# Altium schematic sheet [7]-POWER_DCDC_3V3.SchDoc
size A3; SheetNumber: 8; SheetTotal: 8
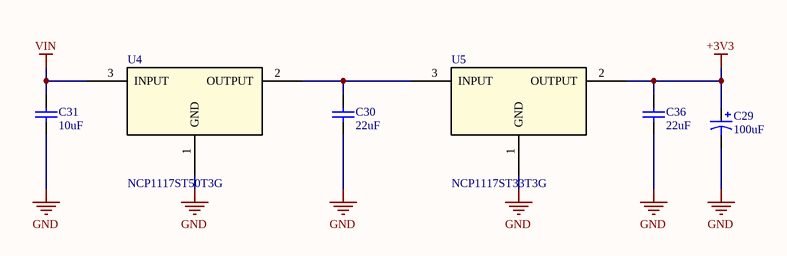
[diagram p0: [7]-POWER_DCDC_3V3.SchDoc]

## Parts
C29  100uF  [CAPAE6553X55M]
C30  22uF  [CAPC2012N]
C31  10uF  [CAPC2012N]
C36  22uF  [CAPC2012N]
U4  NCP1117ST50T3G  [SOT230P700X180-4N]
U5  NCP1117ST33T3G  [SOT230P700X180-4N]

## Nets
+3V3: C29.1 C36.2 U5.2(OUTPUT)
GND: C29.2 C30.1 C31.1 C36.1 U4.1(GND) U5.1(GND)
VIN: C31.2 U4.3(INPUT)
NetC30_2: C30.2 U4.2(OUTPUT) U5.3(INPUT)

## Library data of the parts
C29 = EEE-1AA101WR: CAP ALUM 100UF 20% 10V SMD; Manufacturer 1: Panasonic ECG; Description 1: Cap Aluminum Lytic 100uF 10V 20% (5 X 5.4mm) SMD 50mA 1000h 85C Automotive T/R; Ripple Current: 50mA; Life (Hours): 1000Hour; Supplier 1: Digi-Key; Manufacturer Part Number 1: EEE-1AA101WR; Stock 1: 122621; Pricing 1: 1=0.31, 10=0.212, 100=0.1272, 500=0.0954 (USD); Mount: Surface Mount,PCB; Case/Package: Radial; Contact Plating: Tin; Min Operating Temperature: -40°C; Max Operating Temperature: 85°C; Capacitance: 100uF; Tolerance: 20%; Voltage Rating: 10V; Packaging: Tape and Reel; Package Quantity: 1; Voltage Rating (DC): 10V; Termination: SMD/SMT; Ripple Current (AC): 50mA; Diameter: 5mm; Length: 5.5mm; Height: 5.4mm; Height - Seated (Max): 0.213inch; Radiation Hardening: No; Lead Free: Lead Free; REACH SVHC: Unknown; ComponentLink1URL: https://datasheet.ciiva.com/26945/getdatasheetpartid-169213-26945071.pdf; ComponentLink1Description: https://datasheet.ciiva.com/26945/getdatasheetpartid-169213-26945071.pdf; ComponentLink2URL: https://datasheet.ciiva.com/2983/aba0000ce2-2983906.pdf; ComponentLink2Description: https://datasheet.ciiva.com/2983/aba0000ce2-2983906.pdf; ComponentLink3URL: https://datasheet.ciiva.com/24027/aba0000ce2-40801-24027541.pdf; ComponentLink3Description: https://datasheet.ciiva.com/24027/aba0000ce2-40801-24027541.pdf; ComponentLink4URL: https://datasheet.ciiva.com/30075/11aba0000ce2-30075303.pdf; ComponentLink4Description: https://datasheet.ciiva.com/30075/11aba0000ce2-30075303.pdf; ComponentLink5URL: https://datasheet.ciiva.com/16427/aba0000ce2-16427544.pdf; ComponentLink5Description: https://datasheet.ciiva.com/16427/aba0000ce2-16427544.pdf; ComponentLink6URL: https://datasheet.ciiva.com/14598/70255710-14598233.pdf; ComponentLink6Description: https://datasheet.ciiva.com/14598/70255710-14598233.pdf; ComponentLink7URL: https://datasheet.ciiva.com/14605/70255710-14605689.pdf; ComponentLink7Description: https://datasheet.ciiva.com/14605/70255710-14605689.pdf; ComponentLink8URL: https://datasheet.ciiva.com/11673/aba0000ce2-11673882.pdf; ComponentLink8Description: https://datasheet.ciiva.com/11673/aba0000ce2-11673882.pdf; Supplier Part Number 1: PCE3867CT-ND
C30 C36 = JMK212BJ226MG-T: CAP CER 22UF 6.3V X5R 0805; Manufacturer 1: Taiyo Yuden; PCN Part Number: X5R, X7R Dielectrics 23/Jan/2008; Catalog Drawings: xMK Series_0805_1.25; Capacitance: 22µF; Tolerance: ±20%; Online Catalog: M Series; Kits: 587-1797-KIT-ND  - KIT CAP CER HI CAP 0603 & 0805 S; Other Names: 587-1305-1; Supplier 1: Digi-Key; Manufacturer Part Number 1: JMK212BJ226MG-T; Description 1: CAP CER 22UF 6.3V X5R 0805; Stock 1: 877962; Pricing 1: 1=0.26, 10=0.18, 100=0.1021, 500=0.0721, 1000=0.0631 (USD); Standard Package: 1; Category: Capacitors; Family: Ceramic Capacitors; Series: M; Packaging: Cut Tape (CT); Voltage - Rated: 6.3V; Temperature Coefficient: X5R; Mounting Type: Surface Mount, MLCC; Operating Temperature: -55°C ~ 85°C; Applications: General Purpose; Ratings: -; Package / Case: 0805 (2012 Metric); Size / Dimension: 0.079" L x 0.049" W (2.00mm x 1.25mm); Height - Seated (Max): -; Thickness (Max): 0.053" (1.35mm); Lead Spacing: -; Features: -; Lead Style: -; ComponentLink1URL: https://datasheet.ciiva.com/26872/getdatasheetpartid-637391-26872056.pdf; ComponentLink1Description: https://datasheet.ciiva.com/26872/getdatasheetpartid-637391-26872056.pdf; ComponentLink2URL: https://datasheet.ciiva.com/15921/279jmk212abj226mg-t-15921060.pdf; ComponentLink2Description: https://datasheet.ciiva.com/15921/279jmk212abj226mg-t-15921060.pdf; ComponentLink3URL: https://datasheet.ciiva.com/30094/218jmk212abj226mg-t-30094177.pdf; ComponentLink3Description: https://datasheet.ciiva.com/30094/218jmk212abj226mg-t-30094177.pdf; ComponentLink4URL: https://datasheet.ciiva.com/5424/mlcc-all-e-541559-5424395.pdf; ComponentLink4Description: https://datasheet.ciiva.com/5424/mlcc-all-e-541559-5424395.pdf; ComponentLink5URL: https://datasheet.ciiva.com/137/mlcc-all-e-137394.pdf; ComponentLink5Description: https://datasheet.ciiva.com/137/mlcc-all-e-137394.pdf; ComponentLink6URL: https://datasheet.ciiva.com/137/mlcc-all-e-137395.pdf; ComponentLink6Description: https://datasheet.ciiva.com/137/mlcc-all-e-137395.pdf; ComponentLink7URL: https://datasheet.ciiva.com/137/mlcc-all-e-137396.pdf; ComponentLink7Description: https://datasheet.ciiva.com/137/mlcc-all-e-137396.pdf; Supplier Part Number 1: 587-1305-1-ND
C31 = GRM21BR61E106KA73L: CAP CER 10UF 25V X5R 0805; Manufacturer 1: Murata; Product Training Modules: High-Cap Multilayer Ceramic Capacitors; Catalog Drawings: GRM Series_0805_1.25; Capacitance: 10µF; Tolerance: ±10%; Online Catalog: GRM Series; Other Names: 490-5523-6; Supplier 1: Digi-Key; Manufacturer Part Number 1: GRM21BR61E106KA73L; Description 1: CAP CER 10UF 25V X5R 0805; Stock 1: 1948894; Pricing 1: 1=0.22, 10=0.159, 100=0.0748, 500=0.0524, 1000=0.0434 (USD); Standard Package: 1; Category: Capacitors; Family: Ceramic Capacitors; Series: GRM; Packaging: Digi-Reel®; Voltage - Rated: 25V; Temperature Coefficient: X5R; Mounting Type: Surface Mount, MLCC; Operating Temperature: -55°C ~ 85°C; Applications: General Purpose; Ratings: -; Package / Case: 0805 (2012 Metric); Size / Dimension: 0.079" L x 0.049" W (2.00mm x 1.25mm); Height - Seated (Max): -; Thickness (Max): 0.053" (1.35mm); Lead Spacing: -; Features: -; Lead Style: -; ComponentLink1URL: https://datasheet.ciiva.com/16440/grm21br61e106ka73l-16440627.pdf; ComponentLink1Description: https://datasheet.ciiva.com/16440/grm21br61e106ka73l-16440627.pdf; ComponentLink2URL: https://datasheet.ciiva.com/5424/product-5424327.pdf; ComponentLink2Description: https://datasheet.ciiva.com/5424/product-5424327.pdf; ComponentLink3URL: https://datasheet.ciiva.com/22774/1747469-22774396.pdf; ComponentLink3Description: https://datasheet.ciiva.com/22774/1747469-22774396.pdf; ComponentLink4URL: https://datasheet.ciiva.com/28584/626718-28584288.pdf; ComponentLink4Description: https://datasheet.ciiva.com/28584/626718-28584288.pdf; ComponentLink5URL: https://datasheet.ciiva.com/29199/454623-da-01-en-vs-kondensator-0805-29199615.pdf; ComponentLink5Description: https://datasheet.ciiva.com/29199/454623-da-01-en-vs-kondensator-0805-29199615.pdf; ComponentLink6URL: https://datasheet.ciiva.com/139/partnumbering-e-01-139184.pdf; ComponentLink6Description: https://datasheet.ciiva.com/139/partnumbering-e-01-139184.pdf; ComponentLink7URL: https://datasheet.ciiva.com/139/partnumbering-e-01-139182.pdf; ComponentLink7Description: https://datasheet.ciiva.com/139/partnumbering-e-01-139182.pdf; ComponentLink8URL: https://datasheet.ciiva.com/139/partnumbering-e-01-139183.pdf; ComponentLink8Description: https://datasheet.ciiva.com/139/partnumbering-e-01-139183.pdf; ComponentLink9URL: https://datasheet.ciiva.com/7719/1747469-7719093.pdf; ComponentLink9Description: https://datasheet.ciiva.com/7719/1747469-7719093.pdf; ComponentLink10URL: https://datasheet.ciiva.com/28584/626718-28584279.pdf; ComponentLink10Description: https://datasheet.ciiva.com/28584/626718-28584279.pdf; ComponentLink11URL: https://datasheet.ciiva.com/14116/grmseries-highdielectrictype-eng-14116376.pdf; ComponentLink11Description: https://datasheet.ciiva.com/14116/grmseries-highdielectrictype-eng-14116376.pdf; Supplier Part Number 1: 490-5523-1-ND
U4 = NCP1117ST50T3G: IC REG LINEAR 5V 1A SOT223; Manufacturer 1: ON Semiconductor; Number of Outputs: 1; Max Input Voltage: 20V; Min Input Voltage: 3.5V; Dropout Voltage: 1.2V; Input Bias Current: 6mA; Polarity: Positive; Quiescent Current: 10mA; Output Voltage Accuracy: 1%; Power Rating: 781mW; Output Type: Fixed; Description: LDO Regulator Pos 5V 1A 4-Pin(3+Tab) SOT-223 T/R / IC REG LDO 5V 1A SOT223; Supplier 1: Digi-Key; Manufacturer Part Number 1: NCP1117ST50T3G; RoHS: Yes; Category: Voltage Regulators - Linear; Pricing 1: 4000=0.25323 (USD); Case/Package: SOT-223; Number of Pins: 4; Contact Plating: Tin,Matte; Min Operating Temperature: 0°C; Max Operating Temperature: 125°C; Package Quantity: 1; Output Voltage: 5V; Output Current: 1A; Max Output Current: 1A; Nominal Output Voltage: 5V; Packaging: Tape and Reel; Number of Regulators: 1; Min Current Limit: 1A; Accuracy: 1%; Tolerance: 1%; Length: 6.7mm; Width: 3.7mm; Height: 1.69mm; Radiation Hardening: No; REACH SVHC: No SVHC; Lead Free: Lead Free; Halogen Free: Halogen Free; RoHS Compliant: Yes; ComponentLink1URL: https://datasheet.ciiva.com/28483/1748260-28483320.pdf?src-supplier=Element14; ComponentLink1Description: https://datasheet.ciiva.com/28483/1748260-28483320.pdf?src-supplier=Element14; ComponentLink2URL: https://datasheet.ciiva.com/8073/ncp1117-d-8073902.pdf?src-supplier=Element14; ComponentLink2Description: https://datasheet.ciiva.com/8073/ncp1117-d-8073902.pdf?src-supplier=Element14; ComponentLink3URL: https://datasheet.ciiva.com/8073/ncp1117-d-8073736.pdf?src-supplier=Element14; ComponentLink3Description: https://datasheet.ciiva.com/8073/ncp1117-d-8073736.pdf?src-supplier=Element14; ComponentLink4URL: https://datasheet.ciiva.com/8231/ncp1117-d-8231068.pdf?src-supplier=Avnet; ComponentLink4Description: https://datasheet.ciiva.com/8231/ncp1117-d-8231068.pdf?src-supplier=Avnet; ComponentLink5URL: https://datasheet.ciiva.com/16209/ncp1117-d-16209561.pdf?src-supplier=Future+Electronics; ComponentLink5Description: https://datasheet.ciiva.com/16209/ncp1117-d-16209561.pdf?src-supplier=Future+Electronics; ComponentLink6URL: https://datasheet.ciiva.com/25978/ncp1117-d-25978293.pdf?src-supplier=Avnet+Europe; ComponentLink6Description: https://datasheet.ciiva.com/25978/ncp1117-d-25978293.pdf?src-supplier=Avnet+Europe; ComponentLink7URL: https://datasheet.ciiva.com/16491/ncp1117-d-16491895.pdf?src-supplier=Avnet+Asia; ComponentLink7Description: https://datasheet.ciiva.com/16491/ncp1117-d-16491895.pdf?src-supplier=Avnet+Asia; ComponentLink8URL: https://datasheet.ciiva.com/8233/ncp1117-d-8233593.pdf?src-supplier=Avnet; ComponentLink8Description: https://datasheet.ciiva.com/8233/ncp1117-d-8233593.pdf?src-supplier=Avnet; ComponentLink9URL: https://datasheet.ciiva.com/2042/ncp1117-d-2042019.pdf?src-supplier=Digi-Key; ComponentLink9Description: https://datasheet.ciiva.com/2042/ncp1117-d-2042019.pdf?src-supplier=Digi-Key; ComponentLink10URL: https://datasheet.ciiva.com/2042/ncp1117-d-2042020.pdf?src-supplier=Digi-Key; ComponentLink10Description: https://datasheet.ciiva.com/2042/ncp1117-d-2042020.pdf?src-supplier=Digi-Key; ComponentLink11URL: https://datasheet.ciiva.com/2042/ncp1117-d-2042018.pdf?src-supplier=Digi-Key; ComponentLink11Description: https://datasheet.ciiva.com/2042/ncp1117-d-2042018.pdf?src-supplier=Digi-Key; Supplier Part Number 1: NCP1117ST50T3GOSTR-ND
U5 = NCP1117ST33T3G: IC REG LINEAR 3.3V 1A SOT223; Manufacturer 1: ON Semiconductor; Max Input Voltage: 20V; Number of Outputs: 1; Dropout Voltage: 1.07V; Max Supply Voltage: 15V; Min Supply Voltage: 4.75V; Min Input Voltage: 3.5V; Input Bias Current: 6mA; Quiescent Current: 10mA; Polarity: Positive; Reference Voltage: 1.25V; Accuracy: 1%; Output Type: Fixed; Description: 1.0 A Positive LDO Linear Voltage Regulator (Fixed and Adjustable), V out : 3.3 V; Supplier 1: Digi-Key; Manufacturer Part Number 1: NCP1117ST33T3G; RoHS: Yes; Category: Voltage Regulators - Linear; Pricing 1: 1=0.67000, 10=0.57500, 25=0.53680, 100=0.42950, 250=0.39880, 500=0.33744, 1000=0.26075 (USD); Mount: Surface Mount; Case/Package: SOT-223; Number of Pins: 3; Contact Plating: Tin,Matte; Min Operating Temperature: 0°C; Max Operating Temperature: 125°C; Output Voltage: 3.3V; Packaging: Tape and Reel; Output Current: 1A; Max Output Current: 1A; Package Quantity: 1; Nominal Output Voltage: 3.3V; Number of Regulators: 1; Min Current Limit: 1A; Min Output Voltage: 3.3V; Max Output Voltage: 3.3V; Termination: SMD/SMT; Output Voltage Accuracy: 1%; Length: 6.7mm; Width: 3.7mm; Height: 1.69mm; Radiation Hardening: No; REACH SVHC: No SVHC; Lead Free: Lead Free; Halogen Free: Halogen Free; RoHS Compliant: Yes; ComponentLink1URL: https://datasheet.ciiva.com/22697/1726422-22697602.pdf?src-supplier=Element14; ComponentLink1Description: https://datasheet.ciiva.com/22697/1726422-22697602.pdf?src-supplier=Element14; ComponentLink2URL: https://datasheet.ciiva.com/3224/ncp1117-d-3224144.pdf?src-supplier=Avnet; ComponentLink2Description: https://datasheet.ciiva.com/3224/ncp1117-d-3224144.pdf?src-supplier=Avnet; ComponentLink3URL: https://datasheet.ciiva.com/15111/getdatasheetpartid-82718-15111483.pdf?src-supplier=Verical; ComponentLink3Description: https://datasheet.ciiva.com/15111/getdatasheetpartid-82718-15111483.pdf?src-supplier=Verical; ComponentLink4URL: https://datasheet.ciiva.com/8073/1726422-8073735.pdf?src-supplier=Element14; ComponentLink4Description: https://datasheet.ciiva.com/8073/1726422-8073735.pdf?src-supplier=Element14; ComponentLink5URL: https://datasheet.ciiva.com/28483/1748260-28483307.pdf?src-supplier=Element14; ComponentLink5Description: https://datasheet.ciiva.com/28483/1748260-28483307.pdf?src-supplier=Element14; ComponentLink6URL: https://datasheet.ciiva.com/16382/ncp1117-d-16382636.pdf?src-supplier=Future+Electronics; ComponentLink6Description: https://datasheet.ciiva.com/16382/ncp1117-d-16382636.pdf?src-supplier=Future+Electronics; ComponentLink7URL: https://datasheet.ciiva.com/8233/ncp1117-d-8233589.pdf?src-supplier=Avnet; ComponentLink7Description: https://datasheet.ciiva.com/8233/ncp1117-d-8233589.pdf?src-supplier=Avnet; ComponentLink8URL: https://datasheet.ciiva.com/2042/ncp1117-d-2042028.pdf?src-supplier=Digi-Key; ComponentLink8Description: https://datasheet.ciiva.com/2042/ncp1117-d-2042028.pdf?src-supplier=Digi-Key; ComponentLink9URL: https://datasheet.ciiva.com/2042/ncp1117-d-2042029.pdf?src-supplier=Digi-Key; ComponentLink9Description: https://datasheet.ciiva.com/2042/ncp1117-d-2042029.pdf?src-supplier=Digi-Key; Supplier Part Number 1: NCP1117ST33T3GOSCT-ND